# Altium project ControlBoard.PrjPCB (part 1 of 4)
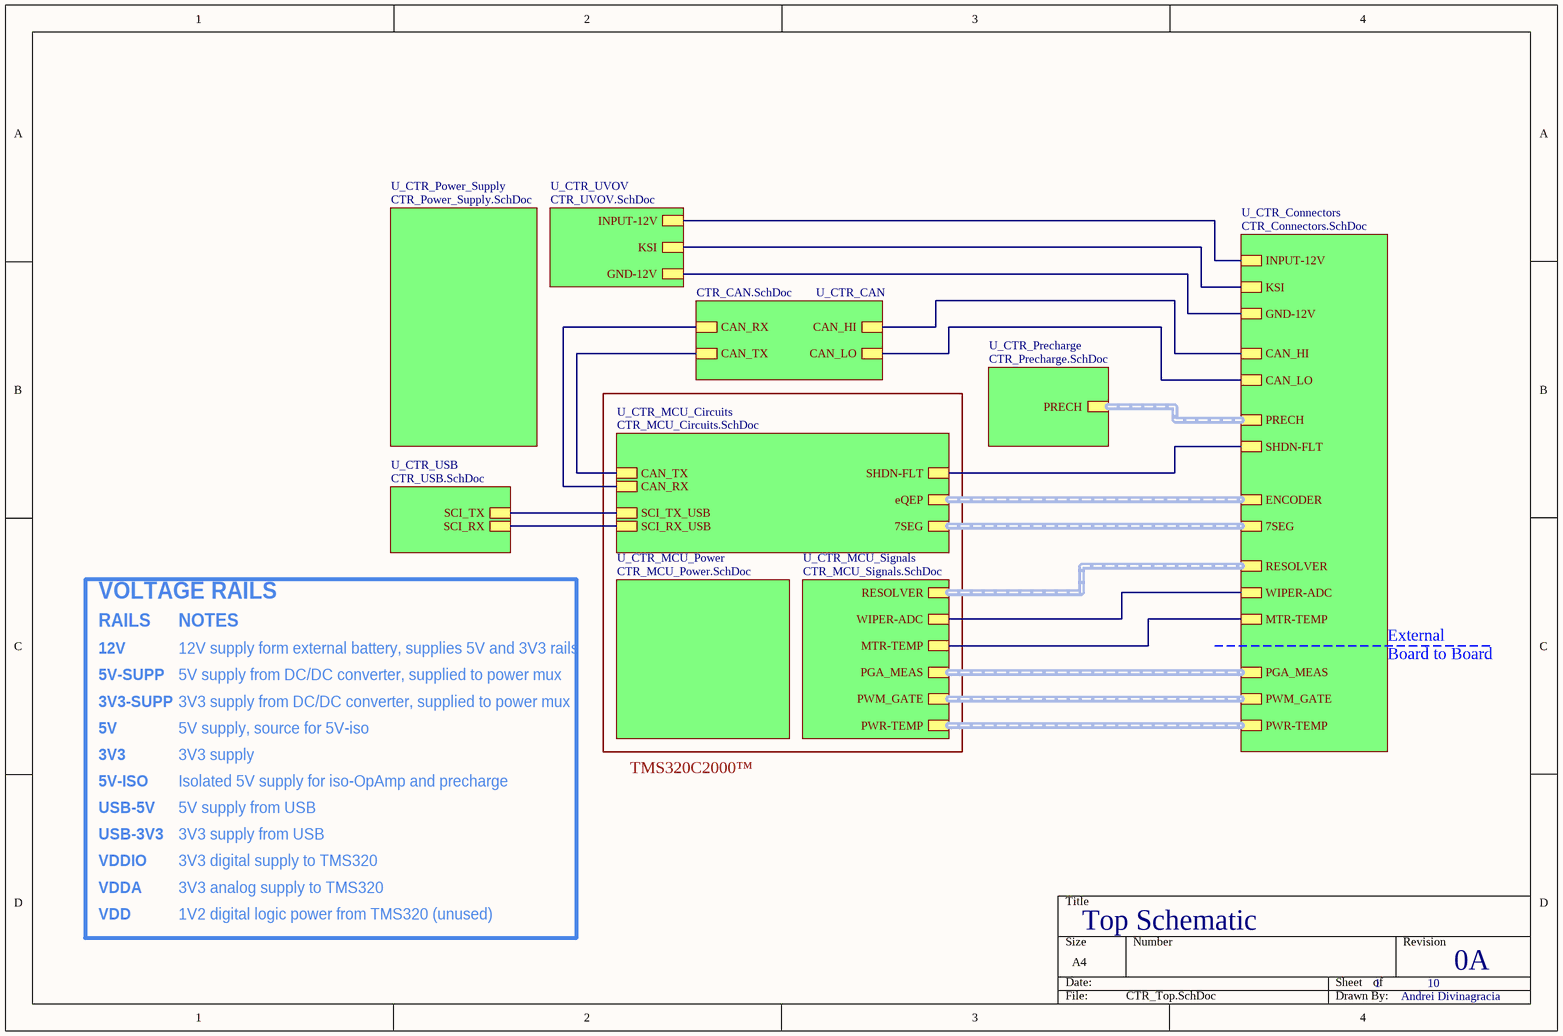
[diagram p0: CTR_Top.SchDoc]
10 sheets, 165 parts. Net scope: hierarchical (ports join the sheet entries above them; power ports are global).
Board file: ControlBoard.PcbDoc
Sheets:
  CTR_Top.SchDoc
    U_CTR_CAN = CTR_CAN.SchDoc
    U_CTR_MCU_Power = CTR_MCU_Power.SchDoc
    U_CTR_Precharge = CTR_Precharge.SchDoc
    U_CTR_USB = CTR_USB.SchDoc
    U_CTR_MCU_Circuits = CTR_MCU_Circuits.SchDoc
    U_CTR_MCU_Signals = CTR_MCU_Signals.SchDoc
    U_CTR_Connectors = CTR_Connectors.SchDoc
    U_CTR_UVOV = CTR_UVOV.SchDoc
    U_CTR_Power_Supply = CTR_Power_Supply.SchDoc

## Sheet CTR_Top.SchDoc: Top Schematic
size A4; DrawnBy: Andrei Divinagracia; Revision: 0A; SheetNumber: 1; SheetTotal: 10

### Sub-sheets
U_CTR_CAN = CTR_CAN.SchDoc: CAN_TX, CAN_RX, CAN_HI, CAN_LO
U_CTR_Connectors = CTR_Connectors.SchDoc: CAN_HI, CAN_LO, KSI, INPUT-12V, MTR-TEMP, GND-12V, WIPER-ADC, ENCODER (harness eQEP-Harness), PGA_MEAS (harness SNS-Harness), PWR-TEMP (harness TEMP-Harness), PWM_GATE (harness GATE-Harness), RESOLVER (harness RESL-Harness), SHDN-FLT, 7SEG (harness 7SEG-Harness), PRECH (harness PRECH-Harness)
U_CTR_MCU_Circuits = CTR_MCU_Circuits.SchDoc: CAN_TX, CAN_RX, SCI_TX_USB, SCI_RX_USB, SHDN-FLT, eQEP (harness eQEP-Harness), 7SEG (harness GPIO-Harness)
U_CTR_MCU_Power = CTR_MCU_Power.SchDoc: no entries
U_CTR_MCU_Signals = CTR_MCU_Signals.SchDoc: MTR-TEMP, WIPER-ADC, PGA_MEAS (harness SNS-Harness), PWR-TEMP (harness TEMP-Harness), PWM_GATE (harness GATE-Harness), RESOLVER (harness RESL-Harness)
U_CTR_Power_Supply = CTR_Power_Supply.SchDoc: no entries
U_CTR_Precharge = CTR_Precharge.SchDoc: PRECH (harness PRECH-Harness)
U_CTR_USB = CTR_USB.SchDoc: SCI_TX, SCI_RX
U_CTR_UVOV = CTR_UVOV.SchDoc: INPUT-12V, KSI, GND-12V

### Nets
CON-GND: sheet U_CTR_Connectors/GND-12V, sheet U_CTR_UVOV/GND-12V
CAN_MCU_N: sheet U_CTR_CAN/CAN_RX, sheet U_CTR_MCU_Circuits/CAN_RX
CAN_MCU_P: sheet U_CTR_CAN/CAN_TX, sheet U_CTR_MCU_Circuits/CAN_TX
CAN_OUT_N: sheet U_CTR_CAN/CAN_LO, sheet U_CTR_Connectors/CAN_LO
CAN_OUT_P: sheet U_CTR_CAN/CAN_HI, sheet U_CTR_Connectors/CAN_HI
MTR-TEMP: sheet U_CTR_MCU_Signals/MTR-TEMP, sheet U_CTR_Connectors/MTR-TEMP
NetJ2_7: sheet U_CTR_Connectors/KSI, sheet U_CTR_UVOV/KSI
NetJ2_9: sheet U_CTR_MCU_Circuits/SHDN-FLT, sheet U_CTR_Connectors/SHDN-FLT
NetJ2_19: sheet U_CTR_MCU_Signals/WIPER-ADC, sheet U_CTR_Connectors/WIPER-ADC
NetJ2_23: sheet U_CTR_Connectors/INPUT-12V, sheet U_CTR_UVOV/INPUT-12V
NetU3_1: sheet U_CTR_USB/SCI_TX, sheet U_CTR_MCU_Circuits/SCI_TX_USB
NetU3_2: sheet U_CTR_USB/SCI_RX, sheet U_CTR_MCU_Circuits/SCI_RX_USB

### Buses and harness runs
harness sheet U_CTR_Connectors/7SEG = sheet U_CTR_MCU_Circuits/7SEG
harness sheet U_CTR_Connectors/ENCODER = sheet U_CTR_MCU_Circuits/eQEP
harness sheet U_CTR_Connectors/PGA_MEAS = sheet U_CTR_MCU_Signals/PGA_MEAS
harness sheet U_CTR_Connectors/PRECH = sheet U_CTR_Precharge/PRECH
harness sheet U_CTR_Connectors/PWM_GATE = sheet U_CTR_MCU_Signals/PWM_GATE
harness sheet U_CTR_Connectors/PWR-TEMP = sheet U_CTR_MCU_Signals/PWR-TEMP
harness sheet U_CTR_Connectors/RESOLVER = sheet U_CTR_MCU_Signals/RESOLVER

### Notes on the sheet
- VOLTAGE RAILS
- 12V
- RAILS
- NOTES
- 12V supply form external battery, supplies 5V and 3V3 rails
- External
- 5V-SUPP
- 3V3-SUPP
- 5V supply from DC/DC converter, supplied to power mux
- 3V3 supply from DC/DC converter, supplied to power mux
- Board to Board
- 5V
- 3V3
- 5V-ISO
- 5V supply, source for 5V-iso
- Isolated 5V supply for iso-OpAmp and precharge
- 3V3 supply
- TMS320C2000™
- USB-5V
- USB-3V3
- 5V supply from USB
- 3V3 supply from USB
- VDD
- VDDIO
- VDDA
- 3V3 digital supply to TMS320
- 3V3 analog supply to TMS320
- 1V2 digital logic power from TMS320 (unused)

## Sheet CTR_CAN.SchDoc: CAN
size A4; DrawnBy: Andrei Divinagracia; Revision: 0A; SheetNumber: 8; SheetTotal: 10
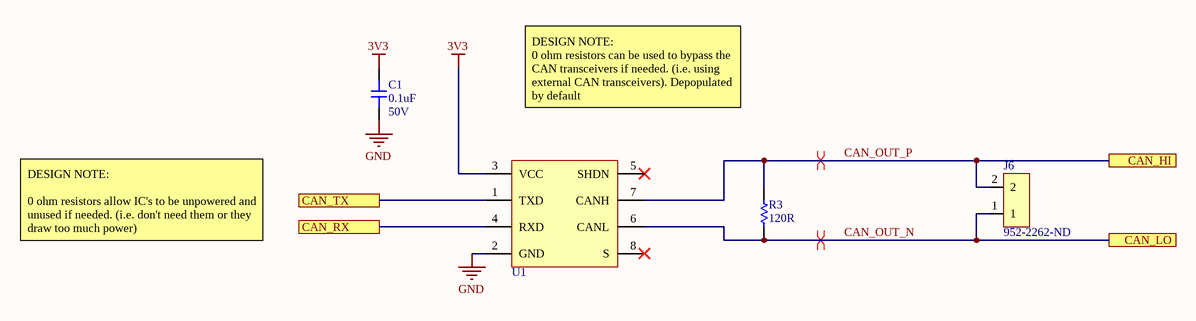
[diagram p1: CTR_CAN.SchDoc]

### Parts
C1  0.1uF  Voltage Rating: 50V  [CAP-0805]
J6  952-2262-ND  [2PIN_HEADER]
R3  120R  [RES-0603]
U1  TCAN332DR  [8-SOIC_MCP2561]  (value not drawn)

### Ports
CAN_HI, CAN_LO, CAN_RX, CAN_TX

### Nets
3V3: C1.2 U1.3(VCC)
GND: C1.1 U1.2(GND)
CAN_MCU_N: U1.4(RXD) ; port CAN_RX
CAN_MCU_P: U1.1(TXD) ; port CAN_TX
CAN_OUT_N: J6.1 R3.1 U1.6(CANL) ; port CAN_LO
CAN_OUT_P: J6.2 R3.2 U1.7(CANH) ; port CAN_HI

Not connected (* = marked no-connect by the designer): U1 5(SHDN)* 8(S)*

### Layout directives
differential pair: CAN_OUT_N, CAN_OUT_P

### Notes on the sheet
- DESIGN NOTE:
  0 ohm resistors can be used to bypass the CAN transceivers if needed. (i.e. using external CAN transceivers). Depopulated by default
- DESIGN NOTE:
  0 ohm resistors allow IC's to be unpowered and unused if needed. (i.e. don't need them or they draw too much power)

### Library data of the parts
C1 = 0805-0.1uF-50V: CAP CER 0.1UF 50V Y5V 0805; Manufacturer: KEMET; Manufacturer Part Number: C0805C104Z5VACTU; Dielectric Material: Ceramic; Tolerance: 80%; Dissipation Factor: 5%; Capacitance: 100nF; Supplier 1: Digi-Key; Stock 1: 929243; Pricing 1: 1=0.1, 10=0.057, 100=0.0254, 500=0.01818, 1000=0.01428 (USD); Mount: Surface Mount,PCB; Case/Package: 0805; Number of Pins: 2; Case Code (Metric): 2012; Case Code (Imperial): 0805; Min Operating Temperature: -30°C; Max Operating Temperature: 85°C; Package Quantity: 1; Packaging: Tape and Reel; Voltage Rating (DC): 50V; Dielectric: Y5V; Termination: SMD/SMT; Voltage: 50V; Length: 2mm; Height: 0.9mm; Lead Pitch: 0.75mm; Width: 0.049inch; Thickness: 0.039inch; Depth: 1.25mm; Radiation Hardening: No; REACH SVHC: No SVHC; Lead Free: Lead Free; ComponentLink1URL: http://www.alliedelec.com/m/d/9bfe7773041ffe9d406e68bc7b377fdd.pdf?src-supplier=Allied+Electronics; ComponentLink1Description: http://www.alliedelec.com/m/d/9bfe7773041ffe9d406e68bc7b377fdd.pdf?src-supplier=Allied+Electronics; ComponentLink2URL: https://www.verical.com/server-webapp/html/getDatasheet?partID=37101&src-supplier=Verical; ComponentLink2Description: https://www.verical.com/server-webapp/html/getDatasheet?partID=37101&src-supplier=Verical; ComponentLink3URL: https://www.verical.com/server-webapp/html/getDatasheet?partID=321176&src-supplier=Verical; ComponentLink3Description: https://www.verical.com/server-webapp/html/getDatasheet?partID=321176&src-supplier=Verical; ComponentLink4URL: http://www.farnell.com/datasheets/2123124.pdf?src-supplier=Element14; ComponentLink4Description: http://www.farnell.com/datasheets/2123124.pdf?src-supplier=Element14; Supplier Part Number 1: 399-1177-6-ND
J6 = M20-9990246: CONN HEADER VERT 2POS 2.54MM; Manufacturer: Harwin; Contact Resistance: 30mR; Max Current Rating: 3A; Number of Positions: 2; Gender: Male; Connector Type: Male Pin; Insulation Resistance: 10GR; Voltage Rating (AC): 750V; Supplier 1: Digi-Key; Manufacturer Part Number: M20-9990246; Stock 1: 53577; Pricing 1: 1=0.11, 10=0.099, 100=0.0609, 500=0.0504, 1000=0.0441, 5000=0.0378, 10000=0.0368 (USD); Case/Package: SIL; Colour: Black; Housing Colour: Black; Housing Material: Nylon; Contact Plating: Tin; Contact Material: Bronze,Brass; Min Operating Temperature: -40°C; Max Operating Temperature: 105°C; Package Quantity: 1000; Packaging: Bulk; Termination: Solder; Number of Rows: 1; Number of Contacts: 2; Orientation: Straight; Current Rating: 3A; Length: 5.08mm; Depth: 2.54mm; Pitch: 2.54mm; Contact Mating Length: 0.24inch; Radiation Hardening: No; REACH SVHC: No SVHC; ComponentLink1URL: https://datasheet.ciiva.com/8046/315376-8046930.pdf; ComponentLink1Description: https://datasheet.ciiva.com/8046/315376-8046930.pdf; ComponentLink2URL: https://datasheet.ciiva.com/6833/m20-999-6833368.pdf; ComponentLink2Description: https://datasheet.ciiva.com/6833/m20-999-6833368.pdf; ComponentLink3URL: https://datasheet.ciiva.com/11745/0900766b81034e61-11745755.pdf; ComponentLink3Description: https://datasheet.ciiva.com/11745/0900766b81034e61-11745755.pdf; ComponentLink4URL: https://datasheet.ciiva.com/22660/1830818-22660571.pdf; ComponentLink4Description: https://datasheet.ciiva.com/22660/1830818-22660571.pdf; ComponentLink5URL: https://datasheet.ciiva.com/26852/getdatasheetpartid-384170-26852203.pdf; ComponentLink5Description: https://datasheet.ciiva.com/26852/getdatasheetpartid-384170-26852203.pdf; Supplier Part Number 1: 952-2262-ND
R3 = 0603-120R: RES SMD 120 OHM 1% 1/10W 0603; Manufacturer: Yageo; Manufacturer Part Number: RC0603FR-07120RL; Voltage Rating (DC): 50V; Temperature Coefficient: 100ppm/°C; Power Rating: 100mW; Supplier 1: Digi-Key; Stock 1: 1047274; Pricing 1: 1=0.1, 10=0.023, 100=0.0094, 1000=0.00421, 2500=0.00366 (USD); Case/Package: 0603; Number of Pins: 2; Case Code (Metric): 1608; Case Code (Imperial): 0603; Min Operating Temperature: -55°C; Max Operating Temperature: 155°C; Tolerance: 1%; Packaging: Tape and Reel; Composition: Thick Film; Voltage Rating: 50V; Package Quantity: 1; Number of Terminations: 2; Termination: SMD/SMT; Military Standard: Not; Max Power Dissipation: 100mW; Features: Moisture Resistant; Length: 1.6mm; Height: 0.022inch; Width: 0.031inch; Depth: 0.8mm; REACH SVHC: No SVHC; Lead Free: Lead Free; ComponentLink1URL: http://www.yageo.com/documents/recent/PYu-RC_Group_51_RoHS_L_10.pdf?src-supplier=Digi-Key; ComponentLink1Description: http://www.yageo.com/documents/recent/PYu-RC_Group_51_RoHS_L_10.pdf?src-supplier=Digi-Key; ComponentLink2URL: http://www.farnell.com/datasheets/2167052.pdf?src-supplier=Element14; ComponentLink2Description: http://www.farnell.com/datasheets/2167052.pdf?src-supplier=Element14; ComponentLink3URL: http://www.farnell.com/datasheets/1868787.pdf?src-supplier=Element14; ComponentLink3Description: http://www.farnell.com/datasheets/1868787.pdf?src-supplier=Element14; ComponentLink4URL: http://www.farnell.com/datasheets/443971.pdf?src-supplier=Element14; ComponentLink4Description: http://www.farnell.com/datasheets/443971.pdf?src-supplier=Element14; Supplier Part Number 1: 311-120HRDKR-ND; Resistance: 120R
U1 = TCAN332DR: IC TRANSCEIVER 1/1 8SOIC; Manufacturer: Texas Instruments; Data Rate: 1Mbps; Number of Transmit Buffers: 1; Min Supply Voltage: 3V; Max Supply Voltage: 3.6V; Receiver Hysteresis: 120mV; Supplier 1: Digi-Key; Manufacturer Part Number: TCAN332DR; Stock 1: 31835; Pricing 1: 1=2.57, 10=2.312, 25=2.1808, 100=1.8582, 250=1.74476, 500=1.52666, 1000=1.44025 (USD); Mount: Surface Mount; Case/Package: SOIC; Number of Pins: 8; Min Operating Temperature: -40°C; Max Operating Temperature: 125°C; Packaging: Cut Tape; Number of Receive Buffers: 1; REACH SVHC: No SVHC; Lead Free: Lead Free; RoHS Compliant: Yes; ComponentLink1URL: http://www.ti.com/general/docs/lit/getliterature.tsp?genericPartNumber=TCAN332&amp;&amp;fileType=pdf&src-supplier=Farnell; ComponentLink1Description: http://www.ti.com/general/docs/lit/getliterature.tsp?genericPartNumber=TCAN332&amp;&amp;fileType=pdf&src-supplier=Farnell; ComponentLink2URL: http://www.ti.com/general/docs/lit/getliterature.tsp?genericPartNumber=TCAN332&&fileType=pdf&src-supplier=Element14; ComponentLink2Description: http://www.ti.com/general/docs/lit/getliterature.tsp?genericPartNumber=TCAN332&&fileType=pdf&src-supplier=Element14; ComponentLink3URL: http://www.ti.com/lit/ds/symlink/tcan332.pdf?src-supplier=Digi-Key; ComponentLink3Description: http://www.ti.com/lit/ds/symlink/tcan332.pdf?src-supplier=Digi-Key; ComponentLink4URL: http://www.ti.com/lit/gpn/tcan332?src-supplier=Mouser; ComponentLink4Description: http://www.ti.com/lit/gpn/tcan332?src-supplier=Mouser; Supplier Part Number 1: 296-43711-1-ND

## Sheet CTR_MCU_Power.SchDoc: TMS320 Power
size A4; DrawnBy: Andrei Divinagracia; Revision: 0A; SheetNumber: 5; SheetTotal: 10
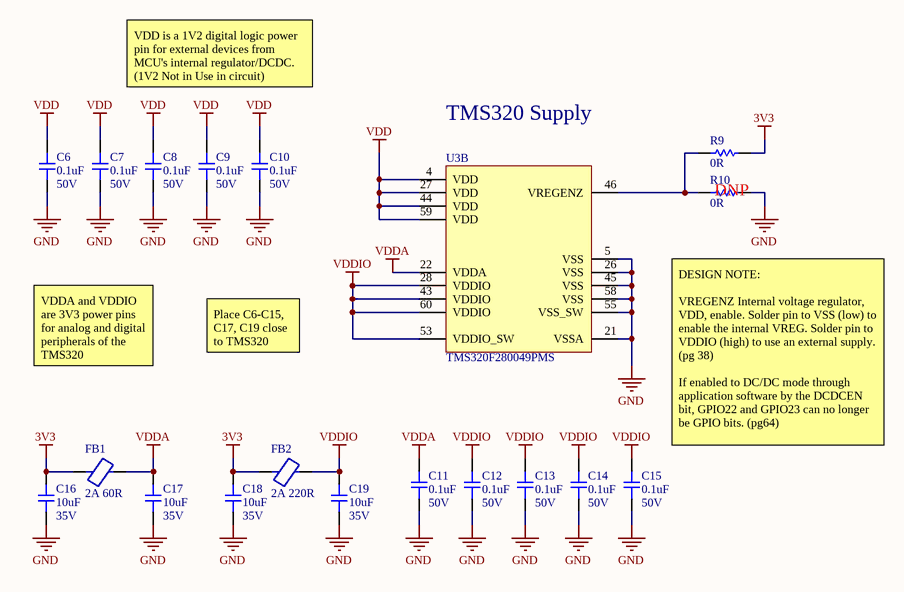
[diagram p2: CTR_MCU_Power.SchDoc]

### Parts
C6  Capacitance: 0.1uF  Voltage Rating: 50V  [CAP-0603]  (hidden comment: 0603-0.1uF-50V)
C7  Capacitance: 0.1uF  Voltage Rating: 50V  [CAP-0603]  (hidden comment: 0603-0.1uF-50V)
C8  Capacitance: 0.1uF  Voltage Rating: 50V  [CAP-0603]  (hidden comment: 0603-0.1uF-50V)
C9  Capacitance: 0.1uF  Voltage Rating: 50V  [CAP-0603]  (hidden comment: 0603-0.1uF-50V)
C10  Capacitance: 0.1uF  Voltage Rating: 50V  [CAP-0603]  (hidden comment: 0603-0.1uF-50V)
C11  Capacitance: 0.1uF  Voltage Rating: 50V  [CAP-0603]  (hidden comment: 0603-0.1uF-50V)
C12  Capacitance: 0.1uF  Voltage Rating: 50V  [CAP-0603]  (hidden comment: 0603-0.1uF-50V)
C13  Capacitance: 0.1uF  Voltage Rating: 50V  [CAP-0603]  (hidden comment: 0603-0.1uF-50V)
C14  Capacitance: 0.1uF  Voltage Rating: 50V  [CAP-0603]  (hidden comment: 0603-0.1uF-50V)
C15  Capacitance: 0.1uF  Voltage Rating: 50V  [CAP-0603]  (hidden comment: 0603-0.1uF-50V)
C16  Capacitance: 10uF  Voltage Rating: 35V  [CAP-0603]  (hidden comment: 0603-10uF-35V)
C17  Capacitance: 10uF  Voltage Rating: 35V  [CAP-0603]  (hidden comment: 0603-10uF-35V)
C18  Capacitance: 10uF  Voltage Rating: 35V  [CAP-0603]  (hidden comment: 0603-10uF-35V)
C19  Capacitance: 10uF  Voltage Rating: 35V  [CAP-0603]  (hidden comment: 0603-10uF-35V)
FB1  2A 60R  [FB-0805]
FB2  2A 220R  [FB-0805]
R9  0R  [RES-0603]
R10  0R  [RES-0603]
U3  TMS320F280049PMS  [64QFP]  (part B of 5)

### Nets
3V3: C16.2 C18.2 FB1.1 FB2.1 R9.2
GND: C6.1 C7.1 C8.1 C9.1 C10.1 C11.1 C12.1 C13.1 C14.1 C15.1 C16.1 C17.1 C18.1 C19.1 R10.2 U3.5(VSS) U3.21(VSSA) U3.26(VSS) U3.45(VSS) U3.55(VSS_SW) U3.58(VSS)
VDD: C6.2 C7.2 C8.2 C9.2 C10.2 U3.4(VDD) U3.27(VDD) U3.44(VDD) U3.59(VDD)
VDDA: C11.2 C17.2 FB1.2 U3.22(VDDA)
VDDIO: C12.2 C13.2 C14.2 C15.2 C19.2 FB2.2 U3.28(VDDIO) U3.43(VDDIO) U3.53(VDDIO_SW) U3.60(VDDIO)
NetR9_1: R9.1 R10.1 U3.46(VREGENZ)

### Notes on the sheet
- VDD is a 1V2 digital logic power pin for external devices from MCU's internal regulator/DCDC.
  (1V2 Not in Use in circuit)
- (near U3) TMS320 Supply
- (near R10) DNP
- VDDA and VDDIO are 3V3 power pins for analog and digital peripherals of the TMS320
- Place C6-C15, C17, C19 close to TMS320
- DESIGN NOTE:
  VREGENZ Internal voltage regulator, VDD, enable. Solder pin to VSS (low) to enable the internal VREG. Solder pin to VDDIO (high) to use an external supply. (pg 38)
  If enabled to DC/DC mode through application software by the DCDCEN bit, GPIO22 and GPIO23 can no longer be GPIO bits. (pg64)

### Library data of the parts
C6-C15 = 0603-0.1uF-50V: CAP CER 0.1UF 50V X7R 0603; Manufacturer: Kyocera AVX; Manufacturer Part Number: 06035C104JAT4A; Supplier 1: Digi-Key; Stock 1: 71529; Pricing 1: 1=0.1, 10=0.07, 50=0.0382, 100=0.0313, 500=0.02234, 1000=0.01755, 2500=0.01596, 5000=0.01468 (USD); RoHS Compliant: Yes; ComponentLink1URL: http://datasheets.avx.com/X7RDielectric.pdf?src-supplier=Digi-Key; ComponentLink1Description: http://datasheets.avx.com/X7RDielectric.pdf?src-supplier=Digi-Key; Supplier Part Number 1: 478-12459-1-ND
C16-C19 = 0603-10uF-35V: CAP CER 10UF 35V X5R 0603; Manufacturer: Murata; Manufacturer Part Number: GRM188R6YA106MA73D; Tolerance: 20%; Supplier 1: Digi-Key; Stock 1: 133; Pricing 1: 1=0.45, 10=0.315, 50=0.2202, 100=0.1887, 500=0.14154, 1000=0.11952 (USD); Mount: Surface Mount; Case/Package: 0603; Case Code (Metric): 1608; Case Code (Imperial): 0603; Min Operating Temperature: -55°C; Max Operating Temperature: 85°C; Packaging: Tape and Reel; Voltage Rating (DC): 35V; Dielectric: X5R; Length: 0.063inch; Width: 0.031inch; Thickness: 0.039inch; RoHS Compliant: Yes; ComponentLink1URL: http://search.murata.co.jp/Ceramy/image/img/A01X/G101/ENG/GRM188R6YA106MA73-01.pdf?src-supplier=Future+Electronics; ComponentLink1Description: http://search.murata.co.jp/Ceramy/image/img/A01X/G101/ENG/GRM188R6YA106MA73-01.pdf?src-supplier=Future+Electronics; ComponentLink2URL: http://search.murata.co.jp/Ceramy/image/img/A01X/G101/ENG/GRM188R6YA106MA73-01.pdf?src-supplier=Digi-Key; ComponentLink2Description: http://search.murata.co.jp/Ceramy/image/img/A01X/G101/ENG/GRM188R6YA106MA73-01.pdf?src-supplier=Digi-Key; ComponentLink3URL: https://www.murata.com/~/media/webrenewal/support/library/catalog/products/capacitor/mlcc/c02e.ashx?la=en-us&src-supplier=Digi-Key; ComponentLink3Description: https://www.murata.com/~/media/webrenewal/support/library/catalog/products/capacitor/mlcc/c02e.ashx?la=en-us&src-supplier=Digi-Key; ComponentLink4URL: http://search.murata.co.jp/Ceramy/image/img/A01X/G101/ENG/GRM188R6YA106MA73-01.pdf?src-supplier=Mouser; ComponentLink4Description: http://search.murata.co.jp/Ceramy/image/img/A01X/G101/ENG/GRM188R6YA106MA73-01.pdf?src-supplier=Mouser; ComponentLink5URL: http://search.murata.co.jp/Ceramy/image/img/A01X/G101/ENG/GRM188R6YA106MA73-01.pdf?src-supplier=TTI; ComponentLink5Description: http://search.murata.co.jp/Ceramy/image/img/A01X/G101/ENG/GRM188R6YA106MA73-01.pdf?src-supplier=TTI; Supplier Part Number 1: 490-13248-1-ND
FB1 = BKP2125HS600-T: FERRITE BEAD 60 OHM 0805 1LN; Manufacturer: Taiyo Yuden; Tolerance: 25%; Resistance: 25mR; Max Current Rating: 3A; Number of Lines: 1; Test Frequency: 100MHz; Shielding: Unshielded; Supplier 1: Digi-Key; Manufacturer Part Number: BKP2125HS600-T; Stock 1: 471; Pricing 1: 1=0.11, 10=0.086, 25=0.0768, 50=0.0564, 100=0.0487, 250=0.03848 (USD); Mount: Surface Mount; Case/Package: 0805; Number of Pins: 2; Core Material: Ferrite; Case Code (Metric): 2125; Case Code (Imperial): 0805; Min Operating Temperature: -55°C; Max Operating Temperature: 85°C; Packaging: Tape and Reel; Impedance: 60R; Package Quantity: 1; DC Resistance (DCR): 25mR; Max DC Current: 3A; Termination: SMD/SMT; Series: BK; Length: 2.3mm; Width: 0.049inch; Height: 1.05mm; Depth: 1.45mm; REACH SVHC: Unknown; Lead Free: Lead Free; Halogen Free: Halogen Free; RoHS Compliant: Yes; ComponentLink1URL: http://ds.yuden.co.jp/TYCOMPAS/ut/detail.do?productNo=BKP2125HS600-T&fileName=BKP2125HS600-T_SS&mode=specSheetDownload&src-supplier=Digi-Key; ComponentLink1Description: http://ds.yuden.co.jp/TYCOMPAS/ut/detail.do?productNo=BKP2125HS600-T&fileName=BKP2125HS600-T_SS&mode=specSheetDownload&src-supplier=Digi-Key; Supplier Part Number 1: 587-1932-1-ND
FB2 = BLM21PG221SN1D: FERRITE BEAD 220 OHM 0805 1LN; Manufacturer: Murata; Material: Ferrite,Steel; Tolerance: 25%; Number of Lines: 1; DC Resistance (DCR): 45mR; Test Frequency: 100MHz; Shielding: Unshielded; Supplier 1: Digi-Key; Manufacturer Part Number: BLM21PG221SN1D; Stock 1: 73275; Pricing 1: 1=0.1, 10=0.081, 25=0.074, 50=0.0666, 100=0.0488, 250=0.03552, 500=0.03256, 1000=0.02812 (USD); Case/Package: 0805; Number of Pins: 2; Core Material: Ferrite; Case Code (Metric): 2012; Case Code (Imperial): 0805; Contact Plating: Tin,Matte; Min Operating Temperature: -55°C; Max Operating Temperature: 125°C; Package Quantity: 1; Impedance: 220R; Max Current Rating: 2A; Packaging: Tape and Reel; Current Rating: 2A; Max DC Current: 2A; Termination: SMD/SMT; DC Current: 2A; Frequency: 100MHz; Number of Circuits: 1; Current: 2A; Series: BLM21P; DC Resistance-Max: 45mR; Length: 2mm; Width: 1.25mm; Height: 0.85mm; Depth: 1.25mm; Radiation Hardening: No; REACH SVHC: No SVHC; Military Standard: Not; Lead Free: Lead Free; RoHS Compliant: Yes; ComponentLink1URL: http://www.farnell.com/datasheets/1914683.pdf?src-supplier=Element14; ComponentLink1Description: http://www.farnell.com/datasheets/1914683.pdf?src-supplier=Element14; ComponentLink2URL: https://www.distrelec.biz/Web/Downloads/ta/_e/anBLM21P_Data_E.pdf?mime=application%2Fpdf&src-supplier=Distrelec; ComponentLink2Description: https://www.distrelec.biz/Web/Downloads/ta/_e/anBLM21P_Data_E.pdf?mime=application%2Fpdf&src-supplier=Distrelec; ComponentLink3URL: http://www.jameco.com/Jameco/Products/ProdDS/1845321.pdf?src-supplier=Jameco; ComponentLink3Description: http://www.jameco.com/Jameco/Products/ProdDS/1845321.pdf?src-supplier=Jameco; ComponentLink4URL: https://www.murata.com/en-us/products/productdata/8796738977822/ENFA0005.pdf?src-supplier=Digi-Key; ComponentLink4Description: https://www.murata.com/en-us/products/productdata/8796738977822/ENFA0005.pdf?src-supplier=Digi-Key; ComponentLink5URL: http://uk.rs-online.com/webdocs/1388/0900766b813885e8.pdf?src-supplier=RSComponents; ComponentLink5Description: http://uk.rs-online.com/webdocs/1388/0900766b813885e8.pdf?src-supplier=RSComponents; ComponentLink6URL: http://search.murata.co.jp/Ceramy/image/img/PDF/ENG/L0110S0100BLM21P.pdf?src-supplier=Avnet; ComponentLink6Description: http://search.murata.co.jp/Ceramy/image/img/PDF/ENG/L0110S0100BLM21P.pdf?src-supplier=Avnet; ComponentLink7URL: http://search.murata.co.jp/Ceramy/image/img/PDF/ENG/L0110S0100BLM21P.pdf?src-supplier=Future+Electronics; ComponentLink7Description: http://search.murata.co.jp/Ceramy/image/img/PDF/ENG/L0110S0100BLM21P.pdf?src-supplier=Future+Electronics; ComponentLink8URL: http://www.produktinfo.conrad.com/datenblaetter/425000-449999/442529-da-01-en-CHIP_DROSSEL_0805_220R_2000MA_2_0X1_25MM.pdf?src-supplier=Conrad; ComponentLink8Description: http://www.produktinfo.conrad.com/datenblaetter/425000-449999/442529-da-01-en-CHIP_DROSSEL_0805_220R_2000MA_2_0X1_25MM.pdf?src-supplier=Conrad; Supplier Part Number 1: 490-1054-1-ND
R9 R10 = 0603-0R: RES SMD 0 OHM JUMPER 1/10W 0603; Manufacturer: Yageo; Manufacturer Part Number: RC0603JR-070RL; Resistance: 0mR; Tolerance: 1%; Voltage Rating: 50V; Power Rating: 100mW; Temperature Coefficient: 200ppm/°C; Supplier 1: Digi-Key; Stock 1: 25658294; Pricing 1: 1=0.1, 10=0.019, 25=0.0136, 50=0.0104, 100=0.0077, 250=0.00588, 500=0.00472, 1000=0.00347 (USD); Case/Package: 0603; Number of Pins: 2; Case Code (Imperial): 0603; Case Code (Metric): 1608; Contact Plating: Tin,Matte; Min Operating Temperature: -55°C; Max Operating Temperature: 155°C; Package Quantity: 5000; Packaging: Tape and Reel; Voltage Rating (DC): 50V; Termination: SMD/SMT; Composition: Thick Film; Military Standard: Not; Length: 1.6mm; Height: 0.45mm; Width: 0.8mm; Depth: 0.8mm; Radiation Hardening: No; REACH SVHC: No SVHC; Lead Free: Lead Free; ComponentLink1URL: http://www.farnell.com/datasheets/2167052.pdf?src-supplier=Element14; ComponentLink1Description: http://www.farnell.com/datasheets/2167052.pdf?src-supplier=Element14; ComponentLink2URL: https://www.verical.com/server-webapp/html/getDatasheet?partID=329462&src-supplier=Verical; ComponentLink2Description: https://www.verical.com/server-webapp/html/getDatasheet?partID=329462&src-supplier=Verical; ComponentLink3URL: http://www.yageo.com/documents/recent/PYu-RC_Group_51_RoHS_L_9.pdf?src-supplier=Mouser; ComponentLink3Description: http://www.yageo.com/documents/recent/PYu-RC_Group_51_RoHS_L_9.pdf?src-supplier=Mouser; ComponentLink4URL: http://www.farnell.com/datasheets/443971.pdf?src-supplier=Element14; ComponentLink4Description: http://www.farnell.com/datasheets/443971.pdf?src-supplier=Element14; ComponentLink5URL: http://documents.rs-components.com/techlib://itc_doclist_GB.htm?stockno=6515918&src-supplier=RSComponents; ComponentLink5Description: http://documents.rs-components.com/techlib://itc_doclist_GB.htm?stockno=6515918&src-supplier=RSComponents; Supplier Part Number 1: 311-0.0GRCT-ND
U3 = TMS320F280049: IC MCU 32BIT 256KB FLASH 64LQFP; Manufacturer: Texas Instruments; Manufacturer Part Number: F280049CPMS; Number of UART Channels: 2; Interface: I2C,SPI,UART,USART,SCI; Peripherals: Brown-out Detect/Reset,POR,PWM,WDT; Frequency: 100MHz; Number of I/Os: 26; Oscillator Type: Internal; Supplier 1: Mouser; Stock 1: 0; Pricing 1: 1=10.7, 10=9.68, 50=9.23, 100=8.01, 1000=6.07, 10000=6.07 (USD); Case/Package: LQFP; Min Operating Temperature: -40°C; Max Operating Temperature: 125°C; Memory Type: FLASH; Packaging: Tray; Memory Size: 256KB; RoHS Compliant: Yes; ComponentLink1URL: http://www.ti.com/lit/pdf/sprui33?src-supplier=Digi-Key; ComponentLink1Description: http://www.ti.com/lit/pdf/sprui33?src-supplier=Digi-Key; Supplier Part Number 1: 595-F280049CPMS

## Sheet CTR_Precharge.SchDoc: Precharge
size A4; DrawnBy: Andrei Divinagracia; Revision: 0A; SheetNumber: 10; SheetTotal: 10
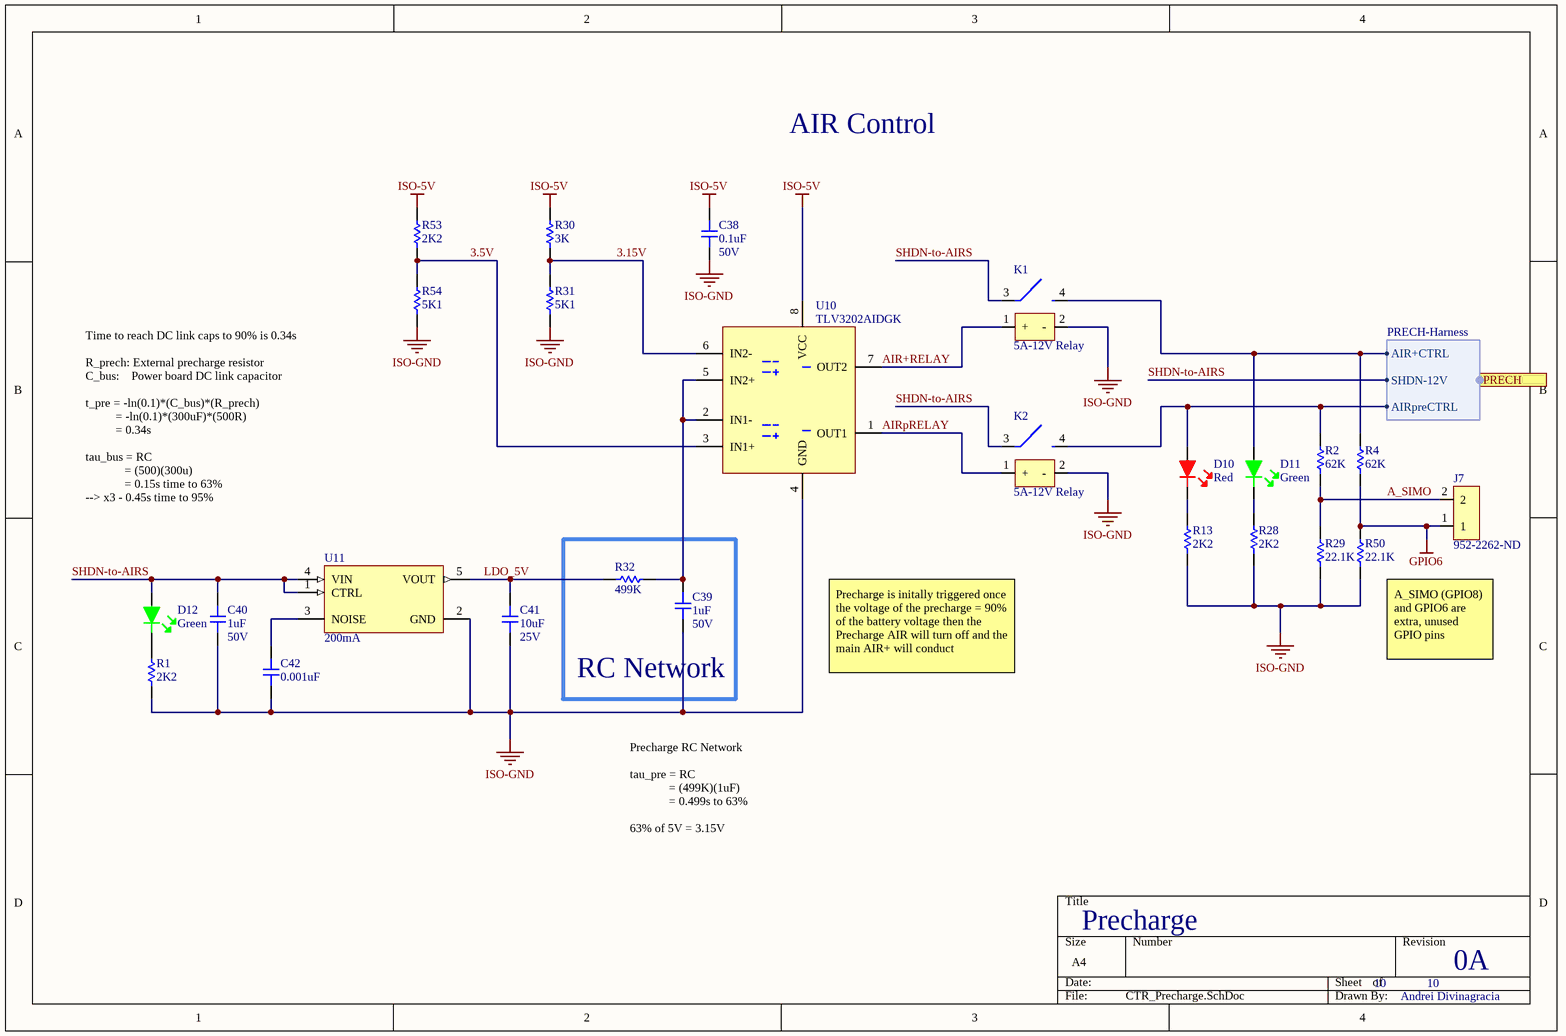
[diagram p3: CTR_Precharge.SchDoc]

### Parts
C38  0.1uF  Voltage Rating: 50V  [CAP-0805]
C39  1uF  Voltage Rating: 50V  [CAP-0805]
C40  1uF  Voltage Rating: 50V  [CAP-0805]
C41  10uF  Voltage Rating: 25V  [CAP-1206]
C42  0.001uF  [CAP-0603]
D10  Red  [LED-0603]
D11  Green  [LED-0603]
D12  Green  [LED-0603]
J7  952-2262-ND  [2PIN_HEADER]
K1  5A-12V Relay  [Relay]
K2  5A-12V Relay  [Relay]
R1  2K2  [RES-0603]
R2  62K  [RES-0603]
R4  62K  [RES-0603]
R13  2K2  [RES-0603]
R28  2K2  [RES-0603]
R29  22.1K  [RES-0603]
R30  3K  [RES-0603]
R31  5K1  [RES-0603]
R32  499K  [RES-0603]
R50  22.1K  [RES-0603]
R53  2K2  [RES-0603]
R54  5K1  [RES-0603]
U10  TLV3202AIDGK  [8VSSOP]
U11  200mA  [SOT-753-ldo]

### Blocks framed on the sheet
RC Network: C39 R32

### Ports
PRECH (harness PRECH-Harness)

### Harnesses
PRECH-Harness: AIRpreCTRL, AIR+CTRL, SHDN-12V

### Nets
GPIO6: J7.1 R4.1 R50.2
ISO-5V: C38.2 R30.2 R53.2 U10.8(VCC)
ISO-GND: C38.1 C39.1 C40.1 C41.1 C42.2 K1.2(-) K2.2(-) R1.1 R13.1 R28.1 R29.1 R31.1 R50.1 R54.1 U10.4(GND) U11.2(GND)
3.5V: R53.1 R54.2 U10.3(IN1+)
3.15V: R30.1 R31.2 U10.6(IN2-)
A_SIMO: J7.2 R2.1 R29.2
AIR+RELAY: K1.1(+) U10.7(OUT2)
AIRpRELAY: K2.1(+) U10.1(OUT1)
LDO_5V: C41.2 R32.1 U11.5(VOUT)
SHDN-to-AIRS: C40.2 D12.1 K1.3 K2.3 U11.1(CTRL) U11.4(VIN) ; port PRECH.SHDN-12V  [project net SHDN-SIG]
NetC39_2: C39.2 R32.2 U10.2(IN1-) U10.5(IN2+)
NetC42_1: C42.1 U11.3(NOISE)
NetD10_1: D10.1 K2.4 R2.2 ; port PRECH.AIRpreCTRL
NetD10_2: D10.2 R13.2
NetD11_1: D11.1 K1.4 R4.2 ; port PRECH.AIR+CTRL
NetD11_2: D11.2 R28.2
NetD12_2: D12.2 R1.2

### Notes on the sheet
- AIR Control
- Time to reach DC link caps to 90% is 0.34s
  R_prech: External precharge resistor
  C_bus:    Power board DC link capacitor
  t_pre = -ln(0.1)*(C_bus)*(R_prech)
  = -ln(0.1)*(300uF)*(500R)
  = 0.34s
  tau_bus = RC
  = (500)(300u)
  = 0.15s time to 63%
  --> x3 - 0.45s time to 95%
- (near R50) A_SIMO (GPIO8) and GPIO6 are extra, unused GPIO pins
- Precharge is initally triggered once the voltage of the precharge = 90% of the battery voltage then the Precharge AIR will turn off and the main AIR+ will conduct
- Precharge RC Network
  tau_pre = RC
  = (499K)(1uF)
  = 0.499s to 63%
  63% of 5V = 3.15V

### Library data of the parts
C38 = 0805-0.1uF-50V: as C1 on sheet CTR_CAN; Supplier 1: Digi-Key; Stock 1: 929243; Pricing 1: 1=0.1, 10=0.057, 100=0.0254, 500=0.01818, 1000=0.01428 (USD); Mount: Surface Mount,PCB; Case/Package: 0805; Number of Pins: 2; Case Code (Metric): 2012; Case Code (Imperial): 0805; Min Operating Temperature: -30°C; Max Operating Temperature: 85°C; Package Quantity: 1; Packaging: Tape and Reel; Voltage Rating (DC): 50V; Dielectric: Y5V; Termination: SMD/SMT; Voltage: 50V; Length: 2mm; Height: 0.9mm; Lead Pitch: 0.75mm; Width: 0.049inch; Thickness: 0.039inch; Depth: 1.25mm; Radiation Hardening: No; REACH SVHC: No SVHC; Lead Free: Lead Free; ComponentLink1URL: http://www.alliedelec.com/m/d/9bfe7773041ffe9d406e68bc7b377fdd.pdf?src-supplier=Allied+Electronics; ComponentLink1Description: http://www.alliedelec.com/m/d/9bfe7773041ffe9d406e68bc7b377fdd.pdf?src-supplier=Allied+Electronics; ComponentLink2URL: https://www.verical.com/server-webapp/html/getDatasheet?partID=37101&src-supplier=Verical; ComponentLink2Description: https://www.verical.com/server-webapp/html/getDatasheet?partID=37101&src-supplier=Verical; ComponentLink3URL: https://www.verical.com/server-webapp/html/getDatasheet?partID=321176&src-supplier=Verical; ComponentLink3Description: https://www.verical.com/server-webapp/html/getDatasheet?partID=321176&src-supplier=Verical; ComponentLink4URL: http://www.farnell.com/datasheets/2123124.pdf?src-supplier=Element14; ComponentLink4Description: http://www.farnell.com/datasheets/2123124.pdf?src-supplier=Element14; Supplier Part Number 1: 399-1177-6-ND
C39 C40 = 0805-1uF-50V: CAP CER 1UF 50V X5R 0805; Manufacturer: KEMET; Manufacturer Part Number: C0805C105K5PACTU; Dielectric Material: Ceramic; Tolerance: 10%; Supplier 1: Digi-Key; Stock 1: 7193; Pricing 1: 1=0.33, 10=0.23, 100=0.1378, 500=0.10334, 1000=0.08726 (USD); Mount: Surface Mount; Case/Package: 0805; Weight: 0.000194oz; Case Code (Metric): 2012; Case Code (Imperial): 0805; Min Operating Temperature: -55°C; Max Operating Temperature: 85°C; Dielectric: X5R; Packaging: Tape and Reel; Termination: SMD/SMT; Voltage Rating (DC): 50V; Package Quantity: 2500; Length: 0.079inch; Width: 0.049inch; Thickness: 0.055inch; REACH SVHC: No SVHC; Lead Free: Lead Free; ComponentLink1URL: https://api.kemet.com/component-edge/download/datasheet/C0805C105K5PAC7800.pdf?src-supplier=Digi-Key; ComponentLink1Description: https://api.kemet.com/component-edge/download/datasheet/C0805C105K5PAC7800.pdf?src-supplier=Digi-Key; ComponentLink2URL: http://www.farnell.com/datasheets/2746140.pdf?src-supplier=Farnell; ComponentLink2Description: http://www.farnell.com/datasheets/2746140.pdf?src-supplier=Farnell; ComponentLink3URL: http://www.mouser.com/ds/2/212/KEM_C1006_X5R_SMD-1103249.pdf?src-supplier=Mouser; ComponentLink3Description: http://www.mouser.com/ds/2/212/KEM_C1006_X5R_SMD-1103249.pdf?src-supplier=Mouser; ComponentLink4URL: http://www.farnell.com/datasheets/2746140.pdf?src-supplier=Newark; ComponentLink4Description: http://www.farnell.com/datasheets/2746140.pdf?src-supplier=Newark; ComponentLink5URL: http://www.farnell.com/datasheets/2032728.pdf?src-supplier=Element14; ComponentLink5Description: http://www.farnell.com/datasheets/2032728.pdf?src-supplier=Element14; Supplier Part Number 1: 399-15436-6-ND; Capacitance: 1uF
C41 = 1206-10uF-25V: CAP CER 10UF 25V X7R 1206; Manufacturer: Samsung; Manufacturer Part Number: CL31B106KAHZW6E; Tolerance: 10%; Supplier 1: Digi-Key; Stock 1: 9279; Pricing 1: 1=0.37, 10=0.255, 50=0.1786, 100=0.153, 500=0.11478, 1000=0.09693 (USD); Mount: Surface Mount; Case/Package: 1206; Case Code (Imperial): 1206; Case Code (Metric): 3216; Min Operating Temperature: -55°C; Max Operating Temperature: 125°C; Features: Soft Termination; Packaging: Cut Tape; Capacitance: 10uF; RoHS Compliant: Yes; ComponentLink1URL: http://www.samsungsem.com/kr/support/product-search/mlcc/CL31B106KAHZW6E.jsp?src-supplier=Digi-Key; ComponentLink1Description: http://www.samsungsem.com/kr/support/product-search/mlcc/CL31B106KAHZW6E.jsp?src-supplier=Digi-Key; Supplier Part Number 1: 1276-7031-1-ND
C42 = 0603-10nF: CAP CER 10000PF 50V X7R 0603; Manufacturer: Kyocera AVX; Manufacturer Part Number: 06035C103KAT4A; Tolerance: 10%; Capacitance: 10nF; Dissipation Factor: 2.5%; Insulation Resistance: 100GR; Supplier 1: Digi-Key; Stock 1: 265526; Pricing 1: 1=0.1, 10=0.035, 50=0.019, 100=0.0155, 500=0.01106, 1000=0.0087, 2500=0.00791, 5000=0.00727 (USD); Mount: Surface Mount; Case/Package: 0603; Number of Pins: 2; Case Code (Imperial): 0603; Case Code (Metric): 1608; Min Operating Temperature: -55°C; Max Operating Temperature: 125°C; Package Quantity: 15000; Voltage Rating: 50V; Voltage Rating (DC): 50V; Packaging: Tape and Reel; Dielectric: X7R; Termination: SMD/SMT; Voltage: 50V; Series: -; Construction: Flat; Length: 1.6mm; Width: 0.81mm; Height: 0.9mm; Depth: 0.81mm; Radiation Hardening: No; REACH SVHC: No SVHC; Lead Free: Lead Free; RoHS Compliant: Yes; ComponentLink1URL: http://www.avx.com/docs/catalogs/cx7r.pdf?src-supplier=Avnet; ComponentLink1Description: http://www.avx.com/docs/catalogs/cx7r.pdf?src-supplier=Avnet; ComponentLink2URL: http://datasheets.avx.com/X7RDielectric.pdf?src-supplier=Future+Electronics; ComponentLink2Description: http://datasheets.avx.com/X7RDielectric.pdf?src-supplier=Future+Electronics; ComponentLink3URL: http://www.farnell.com/datasheets/2237835.pdf?src-supplier=Element14; ComponentLink3Description: http://www.farnell.com/datasheets/2237835.pdf?src-supplier=Element14; Supplier Part Number 1: 478-10055-1-ND
D10 = LED-Red: LED RED CLEAR 0603 SMD; Manufacturer: Wurth Electronics; Manufacturer Part Number: 150060RS75000; Viewing Angle: 140°; Lens Style: Clear,Rectangular; Luminous Intensity: 250mcd; Forward Current: 30mA; Forward Voltage: 2V; Wavelength: 625nm; Test Current: 20mA; Supplier 1: Digi-Key; Stock 1: 18518; Pricing 1: 1=0.14, 50=0.133, 100=0.114, 500=0.099 (USD); Mount: Surface Mount; Case/Package: 0603; Color: Red; Case Code (Metric): 1608; Case Code (Imperial): 0603; Min Operating Temperature: -40°C; Max Operating Temperature: 85°C; Package Quantity: 1; Packaging: Cut Tape; Dominant Wavelength: 625nm; Length: 1.6mm; Height: 0.7mm; Width: 0.8mm; REACH SVHC: Unknown; ComponentLink1URL: https://katalog.we-online.de/led/datasheet/150060RS75000.pdf?src-supplier=Digi-Key; ComponentLink1Description: https://katalog.we-online.de/led/datasheet/150060RS75000.pdf?src-supplier=Digi-Key; ComponentLink2URL: http://www.produktinfo.conrad.com/datenblaetter/750000-774999/759428-da-01-en-CHIPLED_0603_W_KL_ROT_150060RS75000.pdf?src-supplier=Conrad; ComponentLink2Description: http://www.produktinfo.conrad.com/datenblaetter/750000-774999/759428-da-01-en-CHIPLED_0603_W_KL_ROT_150060RS75000.pdf?src-supplier=Conrad; Supplier Part Number 1: 732-4978-6-ND
D11 D12 = LED-Green: LED GREEN CLEAR 0603 SMD; Manufacturer: Wurth Electronics; Manufacturer Part Number: 150060VS75000; Luminous Intensity: 40mcd; Viewing Angle: 140°; Forward Voltage: 2V; Wavelength: 570nm; Lens Style: Clear,Rectangular; Forward Current: 30mA; Test Current: 20mA; Supplier 1: Digi-Key; Stock 1: 118118; Pricing 1: 1=0.14, 50=0.133, 100=0.114, 500=0.099 (USD); Mount: Surface Mount; Case/Package: 0603; Number of Pins: 2; Color: Green; Case Code (Metric): 1608; Case Code (Imperial): 0603; Min Operating Temperature: -40°C; Max Operating Temperature: 85°C; Package Quantity: 1; Packaging: Tape and Reel; Dominant Wavelength: 570nm; Length: 1.6mm; Height: 0.7mm; Width: 0.8mm; REACH SVHC: Unknown; ComponentLink1URL: https://katalog.we-online.de/led/datasheet/150060VS75000.pdf?src-supplier=Digi-Key; ComponentLink1Description: https://katalog.we-online.de/led/datasheet/150060VS75000.pdf?src-supplier=Digi-Key; Supplier Part Number 1: 732-4980-1-ND
J7 = M20-9990246: as J6 on sheet CTR_CAN; Supplier 1: Digi-Key; Manufacturer Part Number: M20-9990246; Stock 1: 53577; Pricing 1: 1=0.11, 10=0.099, 100=0.0609, 500=0.0504, 1000=0.0441, 5000=0.0378, 10000=0.0368 (USD); Case/Package: SIL; Colour: Black; Housing Colour: Black; Housing Material: Nylon; Contact Plating: Tin; Contact Material: Bronze,Brass; Min Operating Temperature: -40°C; Max Operating Temperature: 105°C; Package Quantity: 1000; Packaging: Bulk; Termination: Solder; Number of Rows: 1; Number of Contacts: 2; Orientation: Straight; Current Rating: 3A; Length: 5.08mm; Depth: 2.54mm; Pitch: 2.54mm; Contact Mating Length: 0.24inch; Radiation Hardening: No; REACH SVHC: No SVHC; ComponentLink1URL: https://datasheet.ciiva.com/8046/315376-8046930.pdf; ComponentLink1Description: https://datasheet.ciiva.com/8046/315376-8046930.pdf; ComponentLink2URL: https://datasheet.ciiva.com/6833/m20-999-6833368.pdf; ComponentLink2Description: https://datasheet.ciiva.com/6833/m20-999-6833368.pdf; ComponentLink3URL: https://datasheet.ciiva.com/11745/0900766b81034e61-11745755.pdf; ComponentLink3Description: https://datasheet.ciiva.com/11745/0900766b81034e61-11745755.pdf; ComponentLink4URL: https://datasheet.ciiva.com/22660/1830818-22660571.pdf; ComponentLink4Description: https://datasheet.ciiva.com/22660/1830818-22660571.pdf; ComponentLink5URL: https://datasheet.ciiva.com/26852/getdatasheetpartid-384170-26852203.pdf; ComponentLink5Description: https://datasheet.ciiva.com/26852/getdatasheetpartid-384170-26852203.pdf; Supplier Part Number 1: 952-2262-ND
K1 K2 = OJE-SH-112DM,000: General Purpose Relay SPST-NO (1 Form A) 12VDC Coil Through Hole; Manufacturer: TE Connectivity; Contact Current Rating: 5A; Coil Current: 37.5mA; Throw Configuration: SPST; Operate Time: 10ms; Release Time: 4ms; Coil Power: 500mW; Coil Resistance: 320R; Coil Type: Non-Latching; Coil Voltage (DC): 12V; Contact Voltage Rating (DC): 30V; Max Voltage Rating (AC): 265V; Supplier 1: Digi-Key; Manufacturer Part Number: OJE-SH-112DM,000; Stock 1: 912; Pricing 1: 1=1.18, 10=1.105, 25=0.9824, 50=0.9334, 100=0.8843, 250=0.78608, 500=0.73696, 1000=0.68782, 5000=0.66326 (USD); Mount: Through Hole; Number of Pins: 4; Contact Material: Silver; Weight: 9g; Min Operating Temperature: -30°C; Max Operating Temperature: 85°C; Package Quantity: 100; Packaging: Tray; Termination: PCB; Relay Type: General Purpose; Series: OJE, OEG; Max Voltage Rating (DC): 30V; Length: 0.717inch; Width: 0.4inch; Height: 14.7mm; RoHS Compliant: Yes; REACH SVHC: Unknown; Lead Free: Lead Free; ComponentLink1URL: http://www.farnell.com/datasheets/1846831.pdf?src-supplier=Farnell; ComponentLink1Description: http://www.farnell.com/datasheets/1846831.pdf?src-supplier=Farnell; ComponentLink2URL: http://www.onlinecomponents.com/productFiles/mf-PB/ojojeseries.pdf?src-supplier=Onlinecomponents.com; ComponentLink2Description: http://www.onlinecomponents.com/productFiles/mf-PB/ojojeseries.pdf?src-supplier=Onlinecomponents.com; Supplier Part Number 1: PB875-ND
R1 R13 R28 R53 = 0603-2K2: RES SMD 2.2K OHM 5% 1/10W 0603; Manufacturer: Yageo; Manufacturer Part Number: AC0603JR-072K2L; Resistance: 2.2kR; Power Rating: 100mW; Voltage Rating: 50V; Temperature Coefficient: 100ppm/°C; Supplier 1: Digi-Key; Stock 1: 107229; Pricing 1: 1=0.1, 10=0.024, 100=0.0097, 1000=0.00436, 2500=0.00378 (USD); Case/Package: 0603; Case Code (Imperial): 0603; Case Code (Metric): 1608; Contact Plating: Tin,Matte; Min Operating Temperature: -55°C; Max Operating Temperature: 155°C; Tolerance: 5%; Packaging: Tape and Reel; Resistor Type: Thick Film; Termination: SMD/SMT; Number of Terminations: 2; Max Power Dissipation: 100mW; Features: Moisture Resistant,Automotive AEC-Q200; Series: AC; Length: 0.063inch; Width: 0.8mm; Height: 0.022inch; Radiation Hardening: No; Lead Free: Lead Free; RoHS Compliant: Yes; ComponentLink1URL: http://www.mouser.com/ds/2/447/yageodocoutput-1111992.pdf?src-supplier=Mouser; ComponentLink1Description: http://www.mouser.com/ds/2/447/yageodocoutput-1111992.pdf?src-supplier=Mouser; ComponentLink2URL: http://www.yageo.com/documents/recent/PYu-AC_51_RoHS_L_2_revised.pdf?src-supplier=Avnet+Europe; ComponentLink2Description: http://www.yageo.com/documents/recent/PYu-AC_51_RoHS_L_2_revised.pdf?src-supplier=Avnet+Europe; ComponentLink3URL: http://www.yageo.com/NewPortal/yageodocoutput?fileName=/pdf/R-Chip/PYu-AC_51_RoHS_L_6.pdf&src-supplier=Digi-Key; ComponentLink3Description: http://www.yageo.com/NewPortal/yageodocoutput?fileName=/pdf/R-Chip/PYu-AC_51_RoHS_L_6.pdf&src-supplier=Digi-Key; ComponentLink4URL: https://www.yageo.com/upload/media/product/productsearch/datasheet/rchip/PYu-AC_51_RoHS_L_7.pdf?src-supplier=Digi-Key; ComponentLink4Description: https://www.yageo.com/upload/media/product/productsearch/datasheet/rchip/PYu-AC_51_RoHS_L_7.pdf?src-supplier=Digi-Key; Supplier Part Number 1: YAG3657CT-ND
R2 R4 = 0603-62K: RES SMD 62K OHM 1% 1/4W 0603; Manufacturer: Panasonic; Manufacturer Part Number: ERJ-PA3F6202V; Power Rating: 250mW; Resistance: 62kR; Voltage Rating: 150V; Temperature Coefficient: 100ppm/°C; Supplier 1: Digi-Key; Stock 1: 17832; Pricing 1: 1=0.15, 10=0.13, 100=0.05, 1000=0.02201, 2500=0.01901 (USD); Mount: Surface Mount; Case/Package: 0603; Case Code (Metric): 1608; Case Code (Imperial): 0603; Min Operating Temperature: -55°C; Max Operating Temperature: 155°C; Tolerance: 1%; Resistor Type: Thick Film; Packaging: Cut Tape; Number of Terminations: 2; Termination: Solder; Max Power Dissipation: 250mW; Voltage Rating (DC): 150V; Features: Automotive AEC-Q200; Length: 0.063inch; Width: 0.031inch; Height: 0.018inch; Depth: 0.8mm; REACH SVHC: No SVHC; ComponentLink1URL: http://www.farnell.com/datasheets/2059624.pdf?src-supplier=Farnell; ComponentLink1Description: http://www.farnell.com/datasheets/2059624.pdf?src-supplier=Farnell; ComponentLink2URL: http://www.farnell.com/datasheets/1801181.pdf?src-supplier=Element14; ComponentLink2Description: http://www.farnell.com/datasheets/1801181.pdf?src-supplier=Element14; Supplier Part Number 1: P62KBYCT-ND
R29 R50 = 0603-22.1KR: RES SMD 22.1K OHM 1% 1/10W 0603; Manufacturer: Vishay; Manufacturer Part Number: CRCW060322K1FKEA; Power Rating: 100mW; Voltage Rating: 75V; Temperature Coefficient: 100ppm/°C; Resistance: 22.1kR; Supplier 1: Digi-Key; Stock 1: 2740; Pricing 1: 1=0.1, 10=0.036, 100=0.0145, 1000=0.00652, 2500=0.00566 (USD); Mount: Surface Mount; Case/Package: 0603; Weight: 7.1E-05oz; Case Code (Metric): 1608; Case Code (Imperial): 0603; Contact Plating: Tin; Size Code: 0603; Min Operating Temperature: -55°C; Max Operating Temperature: 155°C; Package Quantity: 10; Tolerance: 1%; Packaging: Tape and Reel; Resistor Type: Thick Film; Number of Terminations: 2; Termination: SMD/SMT; Max Power Dissipation: 100mW; Voltage Rating (DC): 75V; Features: Automotive AEC-Q200; Series: CRCW; Resistance Tolerance: 1%; Construction: Rectangular; Technology: THICK FILM; Length: 1.55mm; Width: 0.033inch; Height: 0.45mm; Depth: 0.85mm; Radiation Hardening: No; REACH SVHC: Unknown; Military Standard: Not; Lead Free: Lead Free; RoHS Compliant: Yes; ComponentLink1URL: http://www.farnell.com/datasheets/2046716.pdf?src-supplier=Element14; ComponentLink1Description: http://www.farnell.com/datasheets/2046716.pdf?src-supplier=Element14; ComponentLink2URL: http://www.vishay.com/docs/20035/dcrcwe3.pdf?src-supplier=Digi-Key; ComponentLink2Description: http://www.vishay.com/docs/20035/dcrcwe3.pdf?src-supplier=Digi-Key; ComponentLink3URL: http://uk.rs-online.com/webdocs/0d98/0900766b80d98afc.pdf?src-supplier=RSComponents; ComponentLink3Description: http://uk.rs-online.com/webdocs/0d98/0900766b80d98afc.pdf?src-supplier=RSComponents; ComponentLink4URL: https://www.alliedelec.com/m/d/0c934d6939ccefa68dbe0b96d821c8cf.pdf?src-supplier=Allied+Electronics; ComponentLink4Description: https://www.alliedelec.com/m/d/0c934d6939ccefa68dbe0b96d821c8cf.pdf?src-supplier=Allied+Electronics; ComponentLink5URL: http://www.vishay.com/docs/20035/dcrcwe3.pdf?src-supplier=Avnet; ComponentLink5Description: http://www.vishay.com/docs/20035/dcrcwe3.pdf?src-supplier=Avnet; ComponentLink6URL: http://www.vishay.com/docs/20035/dcrcwe3.pdf?src-supplier=Future+Electronics; ComponentLink6Description: http://www.vishay.com/docs/20035/dcrcwe3.pdf?src-supplier=Future+Electronics; ComponentLink7URL: http://www.vishay.com/docs/20035/dcrcwe3.pdf?src-supplier=Avnet+Europe; ComponentLink7Description: http://www.vishay.com/docs/20035/dcrcwe3.pdf?src-supplier=Avnet+Europe; Supplier Part Number 1: 541-22.1KHDKR-ND
R30 = 0603-3KR: RES SMD 3K OHM 5% 1/10W 0603; Manufacturer: Yageo; Manufacturer Part Number: RC0603JR-073KL; Resistance: 3kR; Power Rating: 100mW; Voltage Rating: 75V; Temperature Coefficient: 100ppm/°C; Voltage Rating (DC): 50V; Supplier 1: Digi-Key; Stock 1: 239018; Pricing 1: 1=0.1, 10=0.02, 100=0.008, 1000=0.0036, 2500=0.00312 (USD); Case/Package: 0603; Number of Pins: 2; Case Code (Imperial): 0603; Case Code (Metric): 1608; Size Code: 0603; Weight: 7.1E-05oz; Min Operating Temperature: -55°C; Max Operating Temperature: 155°C; Tolerance: 5%; Packaging: Tape and Reel; Package Quantity: 1; Termination: SMD/SMT; Resistor Type: Thick Film; Number of Terminations: 2; Max Power Dissipation: 100mW; Features: Moisture Resistant; Series: RC; Resistance Tolerance: 5%; Construction: Rectangular; Length: 1.6mm; Width: 0.8mm; Height: 0.022inch; Depth: 0.8mm; REACH SVHC: No SVHC; Military Standard: Not; Lead Free: Lead Free; RoHS Compliant: Yes; ComponentLink1URL: http://www.yageo.com/documents/recent/PYu-RC_Group_51_RoHS_L_10.pdf?src-supplier=Digi-Key; ComponentLink1Description: http://www.yageo.com/documents/recent/PYu-RC_Group_51_RoHS_L_10.pdf?src-supplier=Digi-Key; ComponentLink2URL: http://www.yageo.com/documents/recent/PYu-RC_Group_51_RoHS_L_9.pdf?src-supplier=Digi-Key; ComponentLink2Description: http://www.yageo.com/documents/recent/PYu-RC_Group_51_RoHS_L_9.pdf?src-supplier=Digi-Key; Supplier Part Number 1: 311-3.0KGRCT-ND
R31 R54 = 0603-5.1KR: RES SMD 5.1K OHM 1% 1/10W 0603; Manufacturer: TE Connectivity; Manufacturer Part Number: 1623257-1; Resistance: 5.1kR; Power Rating: 125mW; Temperature Coefficient: 100ppm/°C; Mount: Surface Mount; Case/Package: 0805; Min Operating Temperature: -55°C; Max Operating Temperature: 125°C; Packaging: Tape and Reel; Tolerance: 1%; Package Quantity: 5000; Resistor Type: Thick Film; Number of Terminations: 2; Series: CRG, Neohm; Max Power Dissipation: 125mW; Construction: Rectangular; Length: 2mm; Width: 0.049inch; Height: 0.026inch; Depth: 1.25mm; Radiation Hardening: No; RoHS Compliant: Yes; Military Standard: Not; ComponentLink1URL: http://www.te.com/commerce/DocumentDelivery/DDEController?Action=showdoc&DocId=Data+Sheet%7F1773204%7FF%7Fpdf%7FEnglish%7FENG_DS_1773204_F.pdf&src-supplier=Avnet+Europe; ComponentLink1Description: http://www.te.com/commerce/DocumentDelivery/DDEController?Action=showdoc&DocId=Data+Sheet%7F1773204%7FF%7Fpdf%7FEnglish%7FENG_DS_1773204_F.pdf&src-supplier=Avnet+Europe; ComponentLink2URL: http://www.te.com/commerce/DocumentDelivery/DDEController?Action=srchrtrv&DocNm=1773204&DocType=DS&DocLang=English&src-supplier=Digi-Key; ComponentLink2Description: http://www.te.com/commerce/DocumentDelivery/DDEController?Action=srchrtrv&DocNm=1773204&DocType=DS&DocLang=English&src-supplier=Digi-Key; ComponentLink3URL: http://www.onlinecomponents.com/productFiles/mf-AMP/eng_ds_1773204_e.pdf?src-supplier=Onlinecomponents.com; ComponentLink3Description: http://www.onlinecomponents.com/productFiles/mf-AMP/eng_ds_1773204_e.pdf?src-supplier=Onlinecomponents.com; Supplier 1: Digi-Key; Supplier Part Number 1: YAG3621CT-ND
R32 = 0603-499KR: RES 499K OHM 1% 1/10W 0603; Manufacturer: Vishay; Manufacturer Part Number: CRCW0603499KFKEAC; Power Rating: 100mW; Resistance: 499kR; Temperature Coefficient: 100ppm/°C; Supplier 1: Digi-Key; Stock 1: 35351; Pricing 1: 1=0.1, 10=0.036, 100=0.0145, 1000=0.00652, 2500=0.00566 (USD); Mount: Surface Mount; Case/Package: SMD/SMT; Contact Plating: Tin; Min Operating Temperature: -55°C; Max Operating Temperature: 155°C; Tolerance: 1%; Resistor Type: Thick Film; Termination: Wraparound; Length: 1.55mm; Lead Free: Lead Free; RoHS Compliant: Yes; Supplier Part Number 1: 541-5445-1-ND
U10 = Compare-TLV3202AIDGK: IC COMPAR PWR RRI DL PP 8VSSOP; Manufacturer: Texas Instruments; Number of Elements: 2; Propagation Delay: 50ns; Min Supply Voltage: 2.7V; Max Supply Voltage: 5.5V; Common Mode Rejection Ratio: 70dB; Nominal Supply Current: 50uA; Max Supply Current: 40uA; Input Bias Current: 50pA; Input Offset Voltage (Vos): 5mV; Response Time: 0.047us; Hysteresis: 1.2mV; Power Supply Rejection Ratio (PSRR): 85dB; Manufacturer Part Number: TLV3202AIDGK; Stock 1: 6035; Pricing 1: 1=1.77, 10=1.59, 25=1.5, 100=1.2, 250=1.05, 500=1.02, 1000=0.81, 2500=0.78, 5000=0.75 (USD); Mount: Surface Mount; Case/Package: VSSOP; Number of Pins: 8; Min Operating Temperature: -40°C; Max Operating Temperature: 125°C; Packaging: Rail/Tube; Package Quantity: 80; Number of Channels: 2; Max Input Current: 50pA; Quiescent Current: 50uA; Type: General Purpose; Length: 3.1mm; Height: 0.95mm; Width: 3.1mm; Radiation Hardening: No; REACH SVHC: No SVHC; Lead Free: Lead Free; ComponentLink1URL: http://www.ti.com/lit/gpn/tlv3202?src-supplier=Mouser; ComponentLink1Description: http://www.ti.com/lit/gpn/tlv3202?src-supplier=Mouser; ComponentLink2URL: http://www.farnell.com/datasheets/1882110.pdf?src-supplier=Element14; ComponentLink2Description: http://www.farnell.com/datasheets/1882110.pdf?src-supplier=Element14; Supplier Part Number 1: 296-34992-ND; Supplier 1: Digi-Key
U11 = TAR5S50TE85LF: IC REG LINEAR 5V 200MA SMV; Manufacturer: Toshiba; Number of Outputs: 1; Min Input Voltage: 5.2V; Max Input Voltage: 15V; Max Power Dissipation: 380mW; Polarity: Positive; Quiescent Current: 850uA; Output Type: Fixed; Supplier 1: Digi-Key; Manufacturer Part Number: TAR5S50TE85LF; Stock 1: 5950; Pricing 1: 1=0.45, 10=0.386, 25=0.36, 100=0.2879, 250=0.26732, 500=0.2262, 1000=0.17479 (USD); Mount: Surface Mount; Number of Pins: 5; Min Operating Temperature: -40°C; Max Operating Temperature: 85°C; Max Output Current: 200mA; Output Voltage: 5V; Radiation Hardening: No; ComponentLink1URL: http://www.semicon.toshiba.co.jp/info/docget.jsp?type=datasheet&lang=en&pid=TAR5S15&src-supplier=Avnet; ComponentLink1Description: http://www.semicon.toshiba.co.jp/info/docget.jsp?type=datasheet&lang=en&pid=TAR5S15&src-supplier=Avnet; ComponentLink2URL: https://toshiba.semicon-storage.com/info/docget.jsp?did=766&amp;prodName=TAR5S40&src-supplier=Digi-Key; ComponentLink2Description: https://toshiba.semicon-storage.com/info/docget.jsp?did=766&amp;prodName=TAR5S40&src-supplier=Digi-Key; ComponentLink3URL: https://toshiba.semicon-storage.com/info/docget.jsp?did=766&prodName=TAR5S40&src-supplier=Digi-Key; ComponentLink3Description: https://toshiba.semicon-storage.com/info/docget.jsp?did=766&prodName=TAR5S40&src-supplier=Digi-Key; Supplier Part Number 1: TAR5S50TE85LFCT-ND